# Altium project Base.PrjPCB
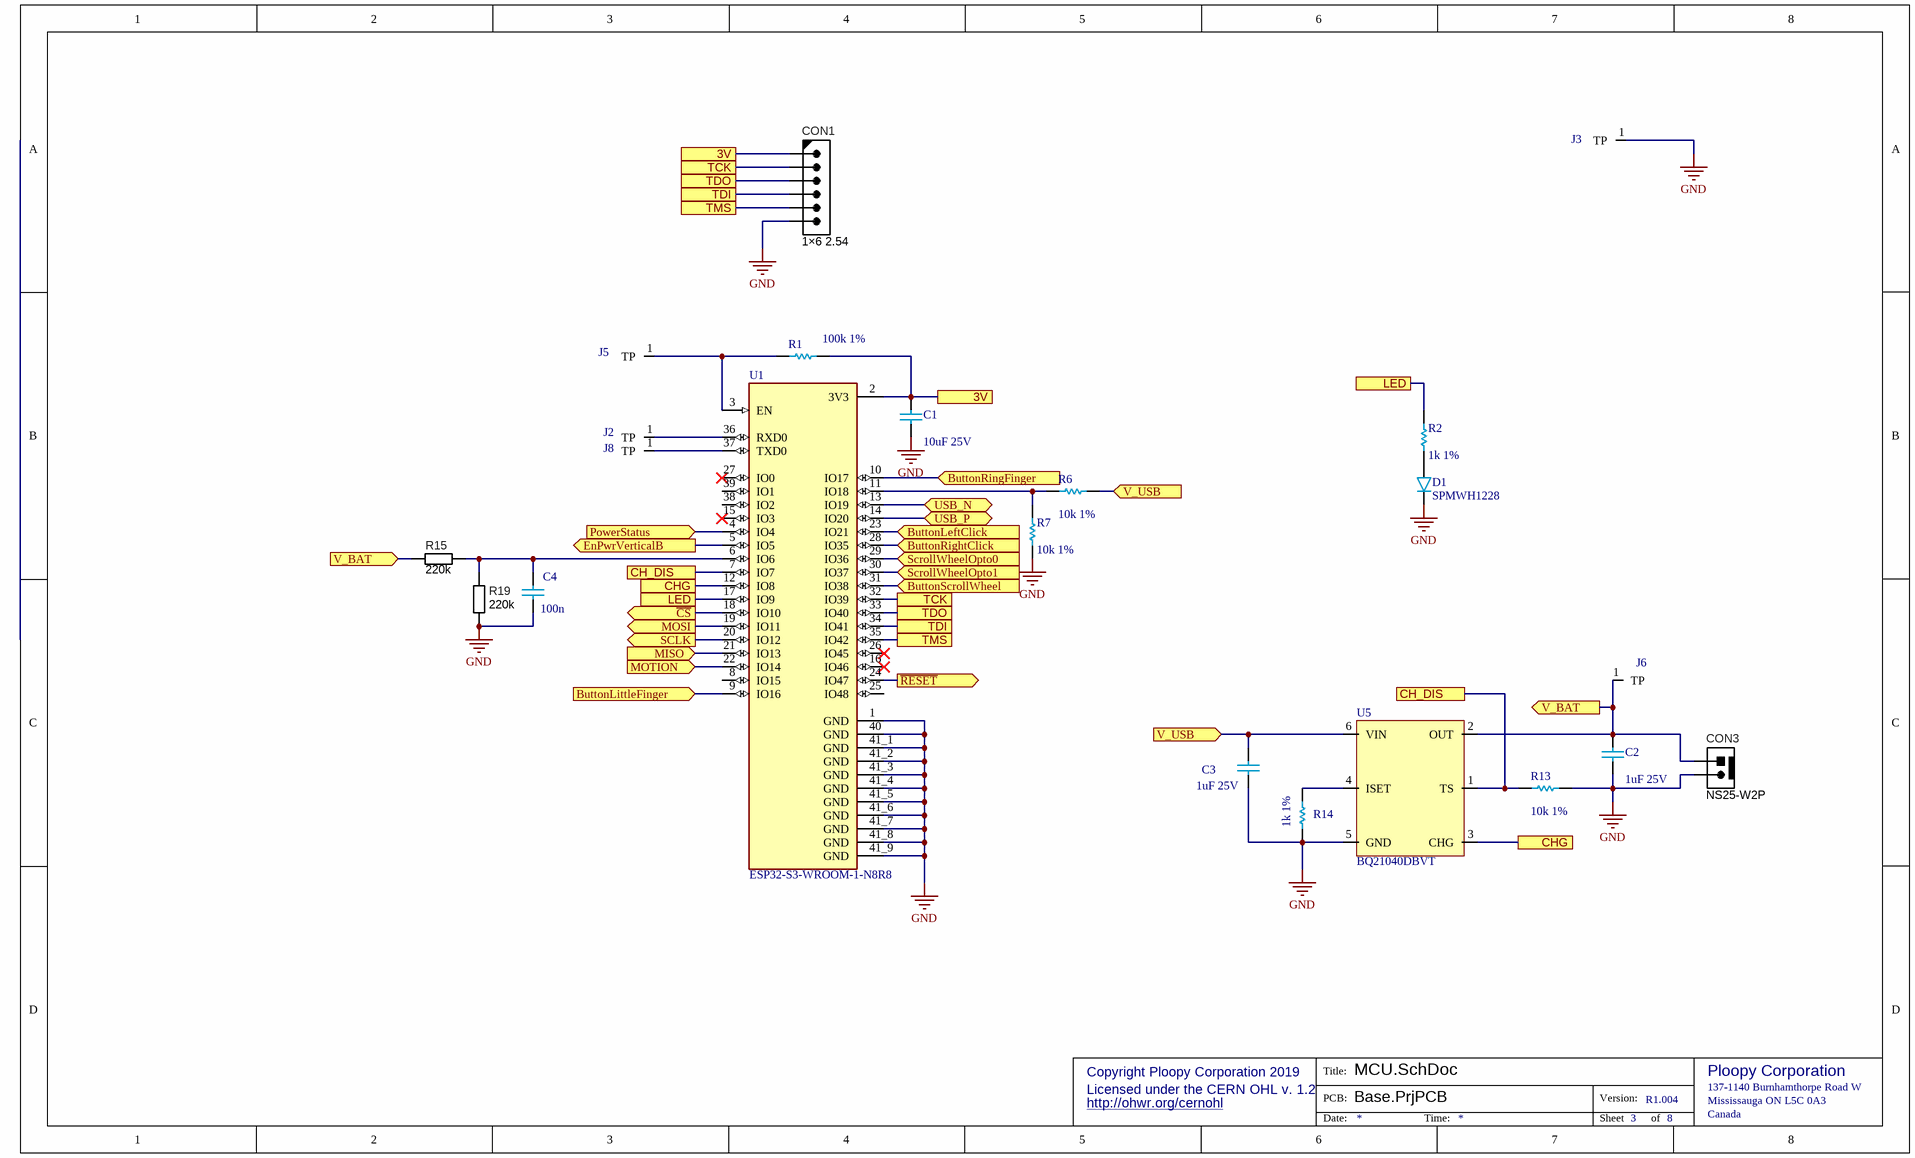
[diagram p0: MCU.SchDoc]
6 sheets, 76 parts. Net scope: flat (ports and power ports of the same name join across sheets).
Board file: Base.PcbDoc
Sheets:
  MCU.SchDoc
  USB.SchDoc
  VerticalPCBConnection.SchDoc
  MouseSensor.SchDoc
  Regulators.SchDoc
  LittleButtons.SchDoc

## Sheet MCU.SchDoc
size Legal; CompanyName: PloopyCo; Organization: Ploopy Co; Address1: 137-1140 Burnhamthorpe Road W; Address2: Mississauga; Address3: Ontario; Address4: Canada L5C 0A3; DocumentNumber: 3; Revision: R1.004; SheetNumber: 3; SheetTotal: 8

### Parts
C1  value 10uF 25V  [C0603]  (hidden comment: 0805)
C2  value 1uF 25V  [C0603]  (hidden comment: 0805)
C3  value 1uF 25V  [C0603]  (hidden comment: 0805)
C4  value 100n  [C0603]  (hidden comment: 0805)
CON1  1×6 2.54  [PH2.54_1X6]
CON3  NS25-W2P  [MOLEST_L2.54_2W]
D1  SPMWH1228  [SPMWH1228]
J2  TestPoint  [TestPoint]  (value not drawn)
J3  TestPoint  [TestPoint]  (value not drawn)
J5  TestPoint  [TestPoint]  (value not drawn)
J6  TestPoint  [TestPoint]  (value not drawn)
J8  TestPoint  [TestPoint]  (value not drawn)
R1  value 100k 1%  [R0603]  (hidden comment: 0805)
R2  value 1k 1%  [R0603]  (hidden comment: 0805)
R6  value 10k 1%  [R0603]  (hidden comment: 0805)
R7  value 10k 1%  [R0603]  (hidden comment: 0805)
R13  value 10k 1%  [R0603]  (hidden comment: 0805)
R14  value 1k 1%  [R0603]  (hidden comment: 0805)
R15  220k  [R0603]
R19  220k  [R0603]
U1  ESP32-S3-WROOM-1-N8R8  [XCVR_ESP32S3WROOM1N8R8]
U5  BQ21040DBVT  [PESD3V3S4UD - SOT95P275X110-6N]

### Ports
3V, ButtonLeftClick (in), ButtonLittleFinger (in), ButtonRightClick (in), ButtonRingFinger (in), ButtonScrollWheel (in), CH_DIS, CHG, EnPwrVerticalB (out), LED, MISO (in), MOSI (out), MOTION (in), PowerStatus (in), SCLK (out), ScrollWheelOpto0 (in), ScrollWheelOpto1 (in), TCK, TDI, TDO, TMS, USB_N (bidir), USB_P (bidir), V_BAT (in), V_BAT (out), V_USB (in), ~{CS} (out), ~{RESET} (out)

### Nets
GND: C1.1 C2.1 C3.1 C4.1 CON1.6 CON3.2 D1.2(C) J3.1(TP) R7.1 R13.1 R14.1 R19.1 U1.1(GND) U1.40(GND) U1.41_1(GND) U1.41_2(GND) U1.41_3(GND) U1.41_4(GND) U1.41_5(GND) U1.41_6(GND) U1.41_7(GND) U1.41_8(GND) U1.41_9(GND) U5.5(GND)
3V: C1.2 CON1.1 R1.2 U1.2(3V3) ; port 3V
ButtonLeftClick: U1.23(IO21) ; port ButtonLeftClick
ButtonLittleFinger: U1.9(IO16) ; port ButtonLittleFinger
ButtonRightClick: U1.28(IO35) ; port ButtonRightClick
ButtonRingFinger: U1.10(IO17) ; port ButtonRingFinger
ButtonScrollWheel: U1.31(IO38) ; port ButtonScrollWheel
~{CS}: U1.18(IO10) ; port ~{CS}
CH_DIS: R13.2 U1.7(IO7) U5.1(TS) ; port CH_DIS
CHG: U1.12(IO8) U5.3(CHG) ; port CHG
EnPwrVerticalB: U1.5(IO5) ; port EnPwrVerticalB
LED: R2.2 U1.17(IO9) ; port LED
MISO: U1.21(IO13) ; port MISO
MOSI: U1.19(IO11) ; port MOSI
MOTION: U1.22(IO14) ; port MOTION
PowerStatus: U1.4(IO4) ; port PowerStatus
~{RESET}: U1.24(IO47) ; port ~{RESET}
SCLK: U1.20(IO12) ; port SCLK
ScrollWheelOpto0: U1.29(IO36) ; port ScrollWheelOpto0
ScrollWheelOpto1: U1.30(IO37) ; port ScrollWheelOpto1
TCK: CON1.2 U1.32(IO39) ; port TCK
TDI: CON1.4 U1.34(IO41) ; port TDI
TDO: CON1.3 U1.33(IO40) ; port TDO
TMS: CON1.5 U1.35(IO42) ; port TMS
USB_N: U1.13(IO19) ; port USB_N
USB_P: U1.14(IO20) ; port USB_P
V_BAT: C2.2 CON3.1 J6.1(TP) R15.1 U5.2(OUT) ; port V_BAT
V_USB: C3.2 R6.2 U5.6(VIN) ; port V_USB
NetC4_2: C4.2 R15.2 R19.2 U1.6(IO6)
NetD1_1: D1.1(A) R2.1
NetJ2_1: J2.1(TP) U1.36(RXD0)
NetJ5_1: J5.1(TP) R1.1 U1.3(EN)
NetJ8_1: J8.1(TP) U1.37(TXD0)
NetR6_1: R6.1 R7.2 U1.11(IO18)
NetR14_2: R14.2 U5.4(ISET)

Not connected (* = marked no-connect by the designer): U1 8(IO15) 15(IO3)* 16(IO46)* 25(IO48) 26(IO45)* 27(IO0)* 38(IO2) 39(IO1)

### Notes on the sheet
- Copyright Ploopy Corporation 2019
- Licensed under the CERN OHL v. 1.2
- http://ohwr.org/cernohl
- Title:
- PCB:
- Version:
- Ploopy Corporation
- Mississauga ON L5C 0A3
- 137-1140 Burnhamthorpe Road W
- Date:
- Time:
- Sheet
- of
- Canada

### Library data of the parts
C1 = Cap 10uF 25V: 0805, X5R or better; PNP-Nzl: 2; PNP-dx: 0; PNP-X: 2.00; PNP-Y: 1.25; PNP-Lv: 1; PNP-TS: 70; PNP-Type: chi; PNP-FeedType: Tape; PNP-TapeWidth: 8; PNP-dy: 0; PNP-Pt: 0; PNP-W: 0; PNP-Thk: 1.25; PNP-Level: 1; PNP-Voff: 0; PNP-PlacePriority: 1; PNP-A: 0; PNP-TapeIndex: 1; Supplier 1: Mouser; Supplier Part Number 1: 81-GRM21BR61E106KA3L; Supplier 2: Digi-Key; Supplier Part Number 2: 490-5523-1-ND; PNP-da: 0
C2-C4 = Cap 1uF 25V: 0805, X5R or better; PNP-Nzl: 2; PNP-dx: 0; PNP-X: 2.00; PNP-Y: 1.25; PNP-Lv: 1; PNP-TS: 70; PNP-Type: chi; PNP-FeedType: Tape; PNP-TapeWidth: 8; Supplier 1: Digi-Key; Supplier Part Number 1: 1276-1066-2-ND; Supplier 2: Digi-Key; Supplier Part Number 2: 1276-1066-1-ND; PNP-dy: 0; PNP-Pt: 0; PNP-W: 0; PNP-Thk: 1.25; PNP-Level: 1; PNP-Voff: 0; PNP-PlacePriority: 1; PNP-A: 0; PNP-TapeIndex: 1; PNP-da: 0
CON1 = PH2.54_1X6: 1x3 standart 100mil pinheader
CON3 = MOLEST_L2.54_2W: Molex-like 2.54mm connector with lock
D1 = SPMWH1228: 3V/0.5W white LED, 2.8mm x 3.5mm; PNP-Nzl: 3; PNP-dx: 0; PNP-X: 2.8; PNP-Y: 3.2; PNP-A: 90; PNP-Thk: 0.65; PNP-Lv: 1; PNP-TS: 70; PNP-Type: chi; PNP-FeedType: Tape; PNP-TapeWidth: 8; PNP-PlacePriority: 2; PNP-da: 550; PNP-dy: 0; PNP-Pt: 0; PNP-W: 0; PNP-Level: 1; PNP-Voff: 0; PNP-TapeIndex: 1; Supplier 2: Digi-Key; Supplier Part Number 2: 1510-1428-1-ND; Supplier 3: Digi-Key; Supplier Part Number 3: 1510-1429-1-ND; Supplier 1: Arrow
R1 = Res 100k 1% 0805: Chip resistor; PNP-Nzl: 2; PNP-dx: 0; PNP-X: 2.00; PNP-Y: 1.25; PNP-Thk: 0.55; PNP-Lv: 1; PNP-TS: 70; PNP-Type: chi; PNP-FeedType: Tape; PNP-TapeWidth: 8; Supplier 1: Digi-Key; Supplier 2: Digi-Key; Supplier Part Number 1: RMCF0805FT100KTR-ND; Supplier Part Number 2: RMCF0805FT100KCT-ND; PNP-dy: 0; PNP-Pt: 0; PNP-W: 0; PNP-Level: 1; PNP-Voff: 0; PNP-PlacePriority: 1; PNP-A: 0; PNP-TapeIndex: 1; PNP-da: 0
R2 R14 = Res 1k 1% 0805: Chip resistor, 1/8W 100PPM; PNP-Nzl: 2; PNP-dx: 0; PNP-X: 2.00; PNP-Y: 1.25; PNP-Thk: 0.55; PNP-Lv: 1; PNP-TS: 70; PNP-Type: chi; PNP-FeedType: Tape; PNP-TapeWidth: 8; Supplier 1: Digi-Key; Supplier Part Number 1: RMCF0805FT1K00TR-ND; PNP-dy: 0; PNP-Pt: 0; PNP-W: 0; PNP-Level: 1; PNP-Voff: 0; PNP-PlacePriority: 1; PNP-A: 0; PNP-TapeIndex: 1; PNP-da: 0
R6 R7 R13 = Res 10k 1% 0805: Chip resistor; PNP-Nzl: 2; PNP-dx: 0; PNP-X: 2.00; PNP-Y: 1.25; PNP-Thk: 0.55; PNP-Lv: 1; PNP-TS: 70; PNP-Type: chi; PNP-FeedType: Tape; PNP-TapeWidth: 8; Supplier 1: Digi-Key; Supplier Part Number 1: RMCF0805FT10K0TR-ND; PNP-dy: 0; PNP-Pt: 0; PNP-W: 0; PNP-Level: 1; PNP-Voff: 0; PNP-PlacePriority: 1; PNP-A: 0; PNP-TapeIndex: 1; PNP-da: 0
R15 R19 = R0603: Generic 0603 resistor footprint
U1 = ESP32-S3-WROOM-1-N8R8: Bluetooth, WiFi 802.11b/g/n, Bluetooth v5.0 Transceiver Module 2.4GHz PCB Trace Surface Mount; MF: Espressif Systems; Package: None; Price: None; Check_prices: https://www.snapeda.com/parts/ESP32-S3-WROOM-1-N8R8/Espressif+Systems/view-part/?ref=eda; Value: *; SnapEDA_Link: https://www.snapeda.com/parts/ESP32-S3-WROOM-1-N8R8/Espressif+Systems/view-part/?ref=snap; MP: ESP32-S3-WROOM-1-N8R8; Availability: In Stock; Purchase-URL: https://pricing.snapeda.com/search?q=ESP32-S3-WROOM-1-N8R8&ref=eda

## Sheet USB.SchDoc
size Letter; CompanyName: PloopyCo; Organization: Ploopy Co; Address1: 137-1140 Burnhamthorpe Road W; Address2: Mississauga; Address3: Ontario; Address4: Canada L5C 0A3; DocumentNumber: 7; Revision: R1.004; SheetNumber: 7; SheetTotal: 8
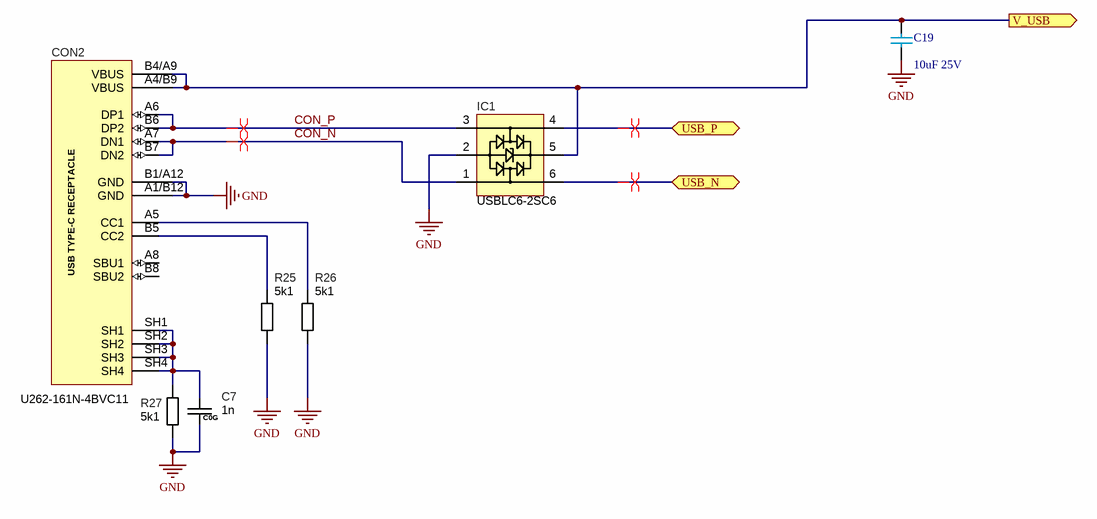
[diagram p1: USB.SchDoc]

### Parts
C7  1n  [C0603_C0G]
C19  value 10uF 25V  [C0603]  (hidden comment: 0805)
CON2  U262-161N-4BVC11  [USB_C]
IC1  USBLC6-2SC6  [sot23-6]
R25  5k1  [R0603]
R26  5k1  [R0603]
R27  5k1  [R0603]

### Ports
USB_N (bidir), USB_P (bidir), V_USB (out)

### Nets
GND: C7.2 C19.1 CON2.A1/B12(GND) CON2.B1/A12(GND) IC1.2(GND) R25.2 R26.2 R27.2
CON_N: CON2.A7(DN1) CON2.B7(DN2) IC1.1
CON_P: CON2.A6(DP1) CON2.B6(DP2) IC1.3
USB_N: IC1.6 ; port USB_N
USB_P: IC1.4 ; port USB_P
V_USB: C19.2 CON2.A4/B9(VBUS) CON2.B4/A9(VBUS) IC1.5(VBUS) ; port V_USB
NetC7_1: C7.1 CON2.SH1 CON2.SH2 CON2.SH3 CON2.SH4 R27.1
NetCON2_A5: CON2.A5(CC1) R26.1
NetCON2_B5: CON2.B5(CC2) R25.1

Not connected (* = marked no-connect by the designer): CON2 A8(SBU1) B8(SBU2)

### Layout directives
differential pair: CON_N, CON_P, USB_N, USB_P

### Notes on the sheet
- Copyright Ploopy Corporation 2019
- Licensed under the CERN OHL v. 1.2
- http://ohwr.org/cernohl
- Title:
- PCB:
- Version:
- Ploopy Corporation
- Mississauga ON L5C 0A3
- 137-1140 Burnhamthorpe Road W
- Date:
- Time:
- Sheet
- of
- Canada
- (in symbol C0603_C0G) C0G
- (in symbol USB_C_2.0) USB TYPE-C RECEPTACLE

### Library data of the parts
C7 = C0603_C0G: Precision 0603 C0G/NP0 capacitor footprint
C19 = Cap 10uF 25V: as C1 on sheet MCU; PNP-dy: 0; PNP-Pt: 0; PNP-W: 0; PNP-Thk: 1.25; PNP-Level: 1; PNP-Voff: 0; PNP-PlacePriority: 1; PNP-A: 0; PNP-TapeIndex: 1; Supplier 1: Mouser; Supplier Part Number 1: 81-GRM21BR61E106KA3L; Supplier 2: Digi-Key; Supplier Part Number 2: 490-5523-1-ND; PNP-da: 0
CON2 = USB_C_2.0: USB C 2.0 connector, SMT, female
IC1 = USBLC6-2SC6: USB 2.0 ESD protection
R25-R27 = R0603: Generic 0603 resistor footprint

## Sheet VerticalPCBConnection.SchDoc
size Letter; CompanyName: PloopyCo; Organization: Ploopy Co; Address1: 137-1140 Burnhamthorpe Road W; Address2: Mississauga; Address3: Ontario; Address4: Canada L5C 0A3; DocumentNumber: 8; Revision: R1.004; SheetNumber: 8; SheetTotal: 8
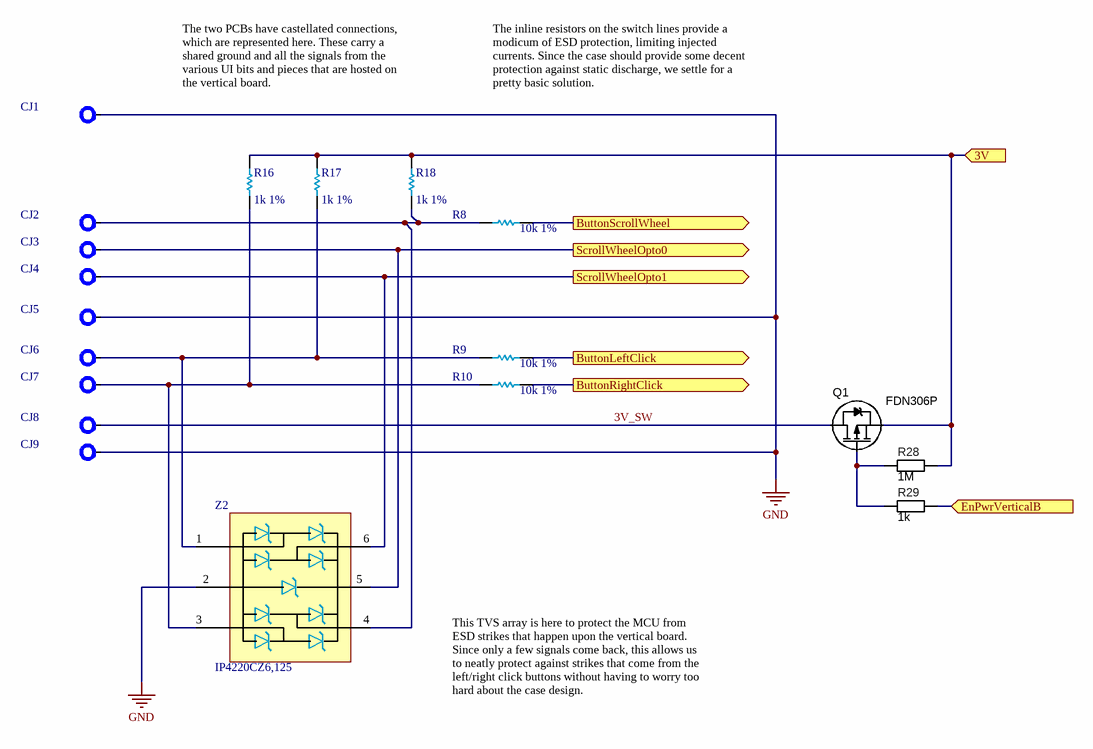
[diagram p2: VerticalPCBConnection.SchDoc]

### Parts
CJ1  PCBJointCastellationJoint  [PCBJoint]  (value not drawn)  (no BOM)
CJ2  PCBJointCastellationJoint  [PCBJoint]  (value not drawn)  (no BOM)
CJ3  PCBJointCastellationJoint  [PCBJoint]  (value not drawn)  (no BOM)
CJ4  PCBJointCastellationJoint  [PCBJoint]  (value not drawn)  (no BOM)
CJ5  PCBJointCastellationJoint  [PCBJoint]  (value not drawn)  (no BOM)
CJ6  PCBJointCastellationJoint  [PCBJoint]  (value not drawn)  (no BOM)
CJ7  PCBJointCastellationJoint  [PCBJoint]  (value not drawn)  (no BOM)
CJ8  PCBJointCastellationJoint  [PCBJoint]  (value not drawn)  (no BOM)
CJ9  PCBJointCastellationJoint  [PCBJoint]  (value not drawn)  (no BOM)
Q1  FDN306P  [SOT23-3]
R8  value 10k 1%  [R0603]  (hidden comment: 0805)
R9  value 10k 1%  [R0603]  (hidden comment: 0805)
R10  value 10k 1%  [R0603]  (hidden comment: 0805)
R16  value 1k 1%  [R0603]  (hidden comment: 0805)
R17  value 1k 1%  [R0603]  (hidden comment: 0805)
R18  value 1k 1%  [R0603]  (hidden comment: 0805)
R28  1M  [R0603]
R29  1k  [R0603]
Z2  IP4220CZ6,125  [PESD3V3S4UD - SOT95P275X110-6N]

### Ports
3V (in), ButtonLeftClick (out), ButtonRightClick (out), ButtonScrollWheel (out), EnPwrVerticalB (in), ScrollWheelOpto0 (out), ScrollWheelOpto1 (out)

### Nets
GND: CJ1.1 CJ5.1 CJ9.1 Z2.2
3V: Q1.2(S) R16.2 R17.2 R18.2 R28.2 ; port 3V
3V_SW: CJ8.1 Q1.3(D)
ButtonLeftClick: R9.2 ; port ButtonLeftClick
ButtonRightClick: R10.2 ; port ButtonRightClick
ButtonScrollWheel: R8.2 ; port ButtonScrollWheel
EnPwrVerticalB: R29.2 ; port EnPwrVerticalB
ScrollWheelOpto0: CJ3.1 Z2.5 ; port ScrollWheelOpto0
ScrollWheelOpto1: CJ4.1 Z2.6 ; port ScrollWheelOpto1
NetCJ2_1: CJ2.1 R8.1 R18.1 Z2.4
NetCJ6_1: CJ6.1 R9.1 R17.1 Z2.1
NetCJ7_1: CJ7.1 R10.1 R16.1 Z2.3
NetQ1_1: Q1.1(G) R28.1 R29.1

### Notes on the sheet
- The two PCBs have castellated connections, which are represented here. These carry a shared ground and all the signals from the various UI bits and pieces that are hosted on the vertical board.
- The inline resistors on the switch lines provide a modicum of ESD protection, limiting injected currents. Since the case should provide some decent protection against static discharge, we settle for a pretty basic solution.
- This TVS array is here to protect the MCU from ESD strikes that happen upon the vertical board. Since only a few signals come back, this allows us to neatly protect against strikes that come from the left/right click buttons without having to worry too hard about the case design.
- Copyright Ploopy Corporation 2019
- Licensed under the CERN OHL v. 1.2
- http://ohwr.org/cernohl
- Title:
- PCB:
- Version:
- Ploopy Corporation
- Mississauga ON L5C 0A3
- 137-1140 Burnhamthorpe Road W
- Date:
- Time:
- Sheet
- of
- Canada

### Library data of the parts
CJ1-CJ9 = PCBJoint: Pad for soldering a castellated PCB edge. Easy way to join two PCBs together.; PNP-Nzl: 2; PNP-dx: 0; PNP-X: 1; PNP-TS: 70; PNP-Type: CHI; PNP-FeedType: Tape; PNP-TapeWidth: 8; PNP-dy: 0; PNP-Y: 1; PNP-A: 0; PNP-Pt: 0; PNP-W: 0; PNP-Thk: 1; PNP-Lv: 1; PNP-Level: 1; PNP-Voff: 0; PNP-PlacePriority: 1; PNP-TapeIndex: 1; PNP-da: 0
Q1 = MOS_P_PMV75UP: 20 V, P-channel, 90mOhm @ 3V3
R8-R10 = Res 10k 1% 0805: as R6 on sheet MCU; Supplier 1: Digi-Key; Supplier Part Number 1: RMCF0805FT10K0TR-ND; PNP-dy: 0; PNP-Pt: 0; PNP-W: 0; PNP-Level: 1; PNP-Voff: 0; PNP-PlacePriority: 1; PNP-A: 0; PNP-TapeIndex: 1; PNP-da: 0
R16-R18 = Res 1k 1% 0805: as R2 on sheet MCU; Supplier 1: Digi-Key; Supplier Part Number 1: RMCF0805FT1K00TR-ND; PNP-dy: 0; PNP-Pt: 0; PNP-W: 0; PNP-Level: 1; PNP-Voff: 0; PNP-PlacePriority: 1; PNP-A: 0; PNP-TapeIndex: 1; PNP-da: 0
R28 R29 = R0603: Generic 0603 resistor footprint
Z2 = IP4220CZ6,125: TVS DIODE 5.5V 6TSOP (Low capacitance, USB); PNP-Nzl: 2; PNP-dx: 0; PNP-X: 2.9; PNP-Y: 1.3; PNP-A: 270; PNP-Thk: 1; PNP-Lv: 26; PNP-TS: 90; PNP-Type: CHP; PNP-FeedType: Tape; PNP-TapeWidth: 8; PNP-PlacePriority: 3; PNP-dy: 0; PNP-Pt: 0; PNP-W: 0; PNP-Level: 1; PNP-Voff: 0; PNP-TapeIndex: 1; PNP-da: 0; Supplier 1: Digi-Key; Supplier 2: Mouser; Supplier 3: Arrow; Supplier Part Number 1: 1727-3578-1-ND; Supplier Part Number 2: 771-IP4220CZ6-T/R; Supplier Part Number 3: IP4220CZ6,125

## Sheet MouseSensor.SchDoc
size Letter; CompanyName: PloopyCo; Organization: Ploopy Co; Address1: 137-1140 Burnhamthorpe Road W; Address2: Mississauga; Address3: Ontario; Address4: Canada L5C 0A3; DocumentNumber: 5; Revision: R1.004; SheetNumber: 5; SheetTotal: 8
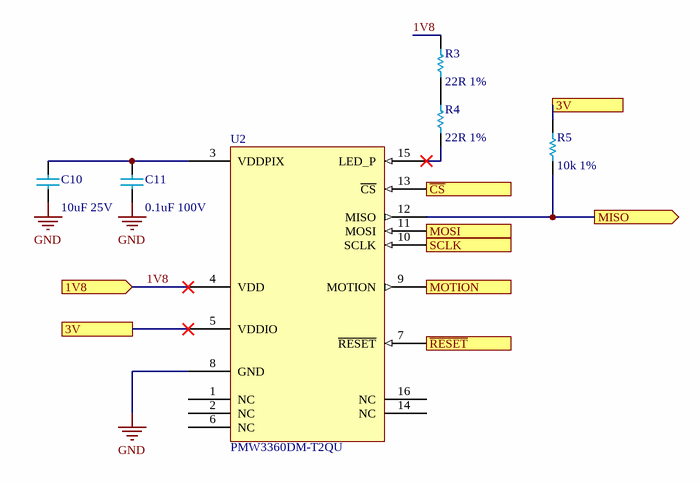
[diagram p3: MouseSensor.SchDoc]

### Parts
C10  value 10uF 25V  [C0603]  (hidden comment: 0805)
C11  value 0.1uF 100V  [C0603]  (hidden comment: 0805)
R3  value 22R 1%  [R0603]  (hidden comment: 0805)
R4  value 22R 1%  [R0603]  (hidden comment: 0805)
R5  value 10k 1%  [R0603]  (hidden comment: 0805)
U2  PMW3360DM-T2QU  [PMW3360DM-T2QU]

### Ports
1V8 (in), 3V, MISO (out), MOSI (in), MOTION (out), SCLK (in), ~{CS} (in), ~{RESET} (in)

### Nets
GND: C10.1 C11.1 U2.8(GND)
1V8: R3.2 U2.4(VDD) ; port 1V8
3V: R5.2 U2.5(VDDIO) ; port 3V
~{CS}: U2.13(~{CS}) ; port ~{CS}
MISO: R5.1 U2.12(MISO) ; port MISO
MOSI: U2.11(MOSI) ; port MOSI
MOTION: U2.9(MOTION) ; port MOTION
~{RESET}: U2.7(~{RESET}) ; port ~{RESET}
SCLK: U2.10(SCLK) ; port SCLK
NetC10_2: C10.2 C11.2 U2.3(VDDPIX)
NetR3_1: R3.1 R4.2
NetR4_1: R4.1 U2.15(LED_P)

Not connected (* = marked no-connect by the designer): U2 1(NC) 2(NC) 6(NC) 14(NC) 16(NC)

### Notes on the sheet
- Copyright Ploopy Corporation 2019
- Licensed under the CERN OHL v. 1.2
- http://ohwr.org/cernohl
- Title:
- PCB:
- Version:
- Ploopy Corporation
- Mississauga ON L5C 0A3
- 137-1140 Burnhamthorpe Road W
- Date:
- Time:
- Sheet
- of
- Canada

### Library data of the parts
C10 = Cap 10uF 25V: as C1 on sheet MCU; PNP-dy: 0; PNP-Pt: 0; PNP-W: 0; PNP-Thk: 1.25; PNP-Level: 1; PNP-Voff: 0; PNP-PlacePriority: 1; PNP-A: 0; PNP-TapeIndex: 1; Supplier 1: Mouser; Supplier Part Number 1: 81-GRM21BR61E106KA3L; Supplier 2: Digi-Key; Supplier Part Number 2: 490-5523-1-ND; PNP-da: 0
C11 = Cap 0.1uF 100V: 0805, X5R or better; PNP-Nzl: 2; PNP-dx: 0; PNP-Level: 1; PNP-Thk: 1.05; PNP-TS: 70; PNP-Type: chi; PNP-X: 2.00; PNP-Y: 1.25; PNP-FeedType: Tape; PNP-TapeWidth: 8; Supplier 1: Digi-Key; Supplier Part Number 1: 1276-6840-2-ND; PNP-dy: 0; PNP-Lv: 1; PNP-Pt: 0; PNP-Voff: 0; PNP-W: 0; PNP-A: 0; PNP-PlacePriority: 1; PNP-TapeIndex: 1; PNP-da: 0
R3 R4 = Res 22R 1% 0805: Chip resistor; PNP-Nzl: 2; PNP-dx: 0; PNP-X: 2.00; PNP-Y: 1.25; PNP-Thk: 0.55; PNP-Lv: 1; PNP-TS: 70; PNP-Type: chi; PNP-FeedType: Tape; PNP-TapeWidth: 8; PNP-dy: 0; PNP-Pt: 0; PNP-W: 0; PNP-Level: 1; PNP-Voff: 0; PNP-PlacePriority: 1; PNP-A: 0; PNP-TapeIndex: 1; PNP-da: 0; Supplier 1: Digi-Key; Supplier 2: Arrow; Supplier Part Number 1: RMCF0805FT22R0CT-ND; Supplier Part Number 2: RMCF0805FT22R0
R5 = Res 10k 1% 0805: as R6 on sheet MCU; Supplier 1: Digi-Key; Supplier Part Number 1: RMCF0805FT10K0TR-ND; PNP-dy: 0; PNP-Pt: 0; PNP-W: 0; PNP-Level: 1; PNP-Voff: 0; PNP-PlacePriority: 1; PNP-A: 0; PNP-TapeIndex: 1; PNP-da: 0
U2 = PMW3360DM-T2QU: Optical Gaming Navigation Sensor; PNP-Nzl: 4; PNP-dx: 0; PNP-X: 4.9; PNP-Y: 3.9; PNP-W: 0.1; PNP-Thk: 1.45; PNP-Lv: 26; PNP-TS: 70; PNP-Level: 1.3; PNP-Type: QFP; PNP-FeedType: Tape; PNP-TapeWidth: 12; PNP-PlacePriority: 3; PNP-TapeIndex: 2; PNP-dy: 0; PNP-A: 0; PNP-Pt: 0; PNP-Voff: 0; PNP-da: 0

## Sheet Regulators.SchDoc
size Letter; CompanyName: PloopyCo; Organization: Ploopy Co; Address1: 137-1140 Burnhamthorpe Road W; Address2: Mississauga; Address3: Ontario; Address4: Canada L5C 0A3; DocumentNumber: 6; Revision: R1.004; SheetNumber: 6; SheetTotal: 8
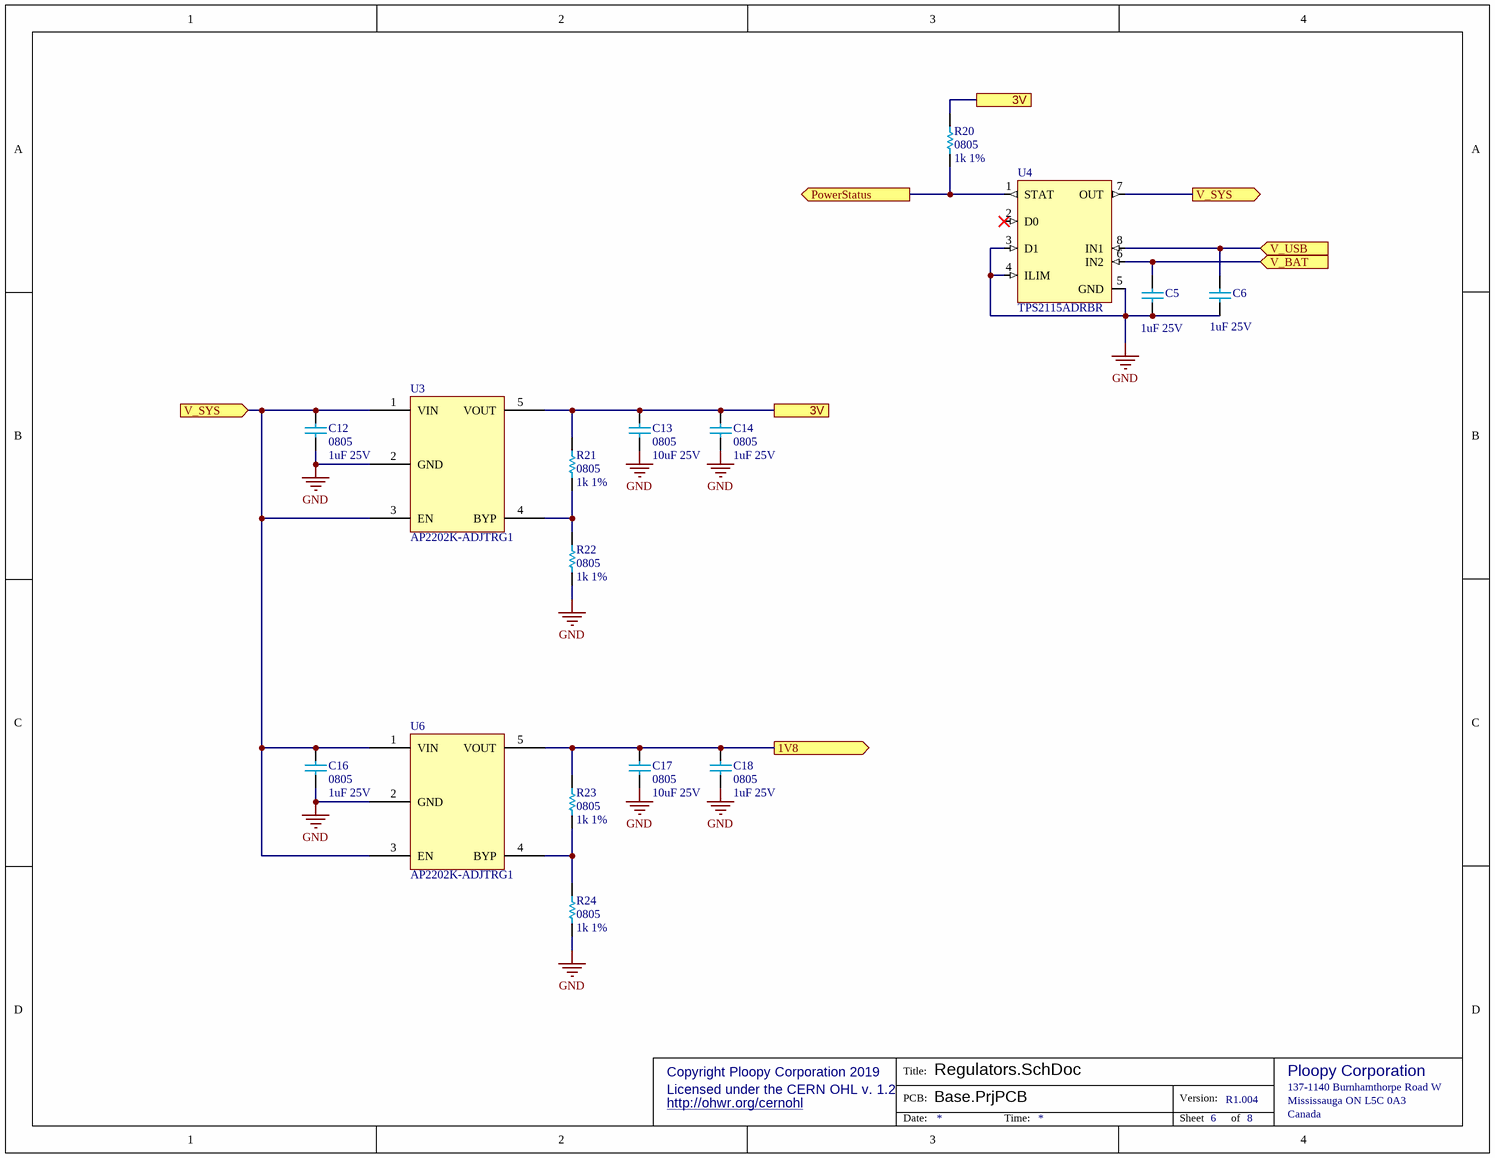
[diagram p4: Regulators.SchDoc]

### Parts
C5  value 1uF 25V  [C0603]  (hidden comment: 0805)
C6  value 1uF 25V  [C0603]  (hidden comment: 0805)
C12  0805  value 1uF 25V  [C0603]
C13  0805  value 10uF 25V  [C0603]
C14  0805  value 1uF 25V  [C0603]
C16  0805  value 1uF 25V  [C0603]
C17  0805  value 10uF 25V  [C0603]
C18  0805  value 1uF 25V  [C0603]
R20  0805  value 1k 1%  [0603]
R21  0805  value 1k 1%  [0603]
R22  0805  value 1k 1%  [0603]
R23  0805  value 1k 1%  [0603]
R24  0805  value 1k 1%  [0603]
U3  AP2202K-ADJTRG1  [AP2202 - SOT95P270X145-5N]
U4  TPS2115ADRBR  [TSSOP-8]
U6  AP2202K-ADJTRG1  [AP2202 - SOT95P270X145-5N]

### Ports
1V8 (out), 3V, PowerStatus (out), V_BAT (in), V_SYS (in), V_SYS (out), V_USB (in)

### Nets
GND: C5.1 C6.1 C12.1 C13.1 C14.1 C16.1 C17.1 C18.1 R22.1 R24.1 U3.2(GND) U4.3(D1) U4.4(ILIM) U4.5(GND) U6.2(GND)
1V8: C17.2 C18.2 R23.2 U6.5(VOUT) ; port 1V8
3V: C13.2 C14.2 R20.2 R21.2 U3.5(VOUT) ; port 3V
PowerStatus: R20.1 U4.1(STAT) ; port PowerStatus
V_BAT: C5.2 U4.6(IN2) ; port V_BAT
V_SYS: C12.2 C16.2 U3.1(VIN) U3.3(EN) U4.7(OUT) U6.1(VIN) U6.3(EN) ; port V_SYS
V_USB: C6.2 U4.8(IN1) ; port V_USB
NetR21_1: R21.1 R22.2 U3.4(BYP)
NetR23_1: R23.1 R24.2 U6.4(BYP)

Not connected (* = marked no-connect by the designer): U4 2(D0)*

### Notes on the sheet
- Copyright Ploopy Corporation 2019
- Licensed under the CERN OHL v. 1.2
- http://ohwr.org/cernohl
- Title:
- PCB:
- Version:
- Ploopy Corporation
- Mississauga ON L5C 0A3
- 137-1140 Burnhamthorpe Road W
- Date:
- Time:
- Sheet
- of
- Canada

### Library data of the parts
C5 C6 C12 C14 C16 C18 = Cap 1uF 25V: 0805, X5R or better; PNP-Nzl: 2; PNP-dx: 0; PNP-Level: 1; PNP-Thk: 1.25; PNP-TS: 70; PNP-Type: chi; PNP-X: 2.00; PNP-FeedType: Tape; PNP-TapeWidth: 8; Supplier 1: Digi-Key; Supplier Part Number 1: 1276-1066-2-ND; Supplier 2: Digi-Key; Supplier Part Number 2: 1276-1066-1-ND; PNP-dy: 0; PNP-Lv: 1; PNP-Pt: 0; PNP-Voff: 0; PNP-W: 0; PNP-Y: 1.25; PNP-A: 0; PNP-PlacePriority: 1; PNP-TapeIndex: 1; PNP-da: 0
C13 C17 = Cap 10uF 25V: as C1 on sheet MCU; PNP-dy: 0; PNP-Pt: 0; PNP-W: 0; PNP-Thk: 1.25; PNP-Level: 1; PNP-Voff: 0; PNP-PlacePriority: 1; PNP-A: 0; PNP-TapeIndex: 1; Supplier 1: Mouser; Supplier Part Number 1: 81-GRM21BR61E106KA3L; Supplier 2: Digi-Key; Supplier Part Number 2: 490-5523-1-ND; PNP-da: 0
R20-R24 = Res 1k 1% 0805: as R2 on sheet MCU; Supplier 1: Digi-Key; Supplier Part Number 1: RMCF0805FT1K00TR-ND; PNP-dy: 0; PNP-Pt: 0; PNP-W: 0; PNP-Level: 1; PNP-Voff: 0; PNP-PlacePriority: 1; PNP-A: 0; PNP-TapeIndex: 1; PNP-da: 0
U3 U6 = AP2202K-3.3: 3.3V 150mA LDO regulator; PNP-Nzl: 2; PNP-dx: 0; PNP-X: 2.9; PNP-Y: 1.3; PNP-A: 90; PNP-Thk: 1; PNP-Lv: 26; PNP-Type: CHP; PNP-FeedType: Tape; PNP-TapeWidth: 8; PNP-PlacePriority: 3; PNP-dy: 0; PNP-Pt: 0; PNP-W: 0; PNP-TS: 90; PNP-Level: 1; PNP-Voff: 0; PNP-TapeIndex: 1; Supplier 1: Mouser; Supplier Part Number 1: 621-AP2202K-3.3TRG1; Supplier 2: Digi-Key; Supplier Part Number 2: AP2202K-3.3TRG1DICT-ND; Supplier 3: Arrow; Supplier Part Number 3: PWagzdsTFFHKE_U17B45SP-NtndBrheJIaI5hB7gHD0ZVywxIBNyoAQstvnyfZZ0; PNP-da: 0

## Sheet LittleButtons.SchDoc
size Letter; CompanyName: PloopyCo; Organization: Ploopy Co; Address1: 137-1140 Burnhamthorpe Road W; Address2: Mississauga; Address3: Ontario; Address4: Canada L5C 0A3; DocumentNumber: 2; Revision: R1.004; SheetNumber: 2; SheetTotal: 8
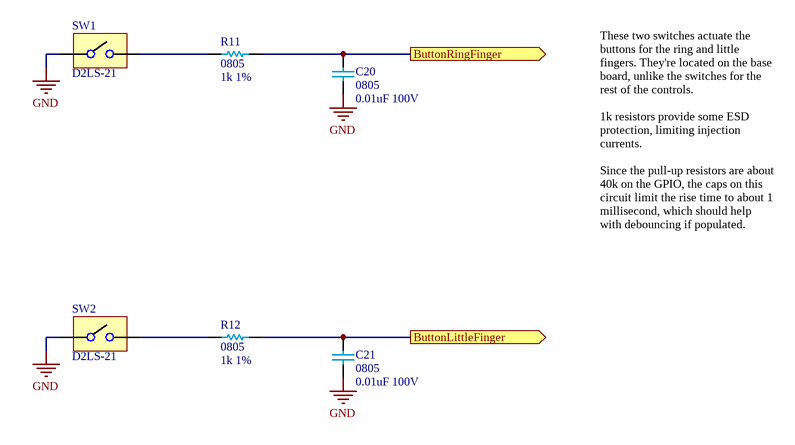
[diagram p5: LittleButtons.SchDoc]

### Parts
C20  0805  value 0.01uF 100V  [C0603]
C21  0805  value 0.01uF 100V  [C0603]
R11  0805  value 1k 1%  [0603]
R12  0805  value 1k 1%  [0603]
SW1  D2LS-21  [D2LS-21]
SW2  D2LS-21  [D2LS-21]

### Ports
ButtonLittleFinger (out), ButtonRingFinger (out)

### Nets
GND: C20.1 C21.1 SW1.A SW2.A
ButtonLittleFinger: C21.2 R12.2 ; port ButtonLittleFinger
ButtonRingFinger: C20.2 R11.2 ; port ButtonRingFinger
NetR11_1: R11.1 SW1.B
NetR12_1: R12.1 SW2.B

### Notes on the sheet
- These two switches actuate the buttons for the ring and little fingers. They're located on the base board, unlike the switches for the rest of the controls.
  1k resistors provide some ESD protection, limiting injection currents.
  Since the pull-up resistors are about 40k on the GPIO, the caps on this circuit limit the rise time to about 1 millisecond, which should help with debouncing if populated.
- Copyright Ploopy Corporation 2019
- Licensed under the CERN OHL v. 1.2
- http://ohwr.org/cernohl
- Title:
- PCB:
- Version:
- Ploopy Corporation
- Mississauga ON L5C 0A3
- 137-1140 Burnhamthorpe Road W
- Date:
- Time:
- Sheet
- of
- Canada

### Library data of the parts
C20 C21 = Cap 0.01uF 100V: 0805, X5R or better; PNP-Nzl: 2; PNP-dx: 0; PNP-X: 2.00; PNP-Y: 1.25; PNP-Thk: 0.85; PNP-Lv: 1; PNP-TS: 70; PNP-Type: chi; PNP-FeedType: Tape; PNP-TapeWidth: 8; PNP-dy: 0; PNP-Pt: 0; PNP-W: 0; PNP-Level: 1; PNP-Voff: 0; PNP-PlacePriority: 1; PNP-A: 0; PNP-TapeIndex: 1; Supplier 1: Digi-Key; Supplier Part Number 1: 1276-6845-2-ND; Supplier 2: Arrow; Supplier Part Number 2: HFLC7Kmwq4-6R2SVzaQAUvCwxvZH1YjWdj_EBba1ByE; PNP-da: 0
R11 R12 = Res 1k 1% 0805: as R2 on sheet MCU; Supplier 1: Digi-Key; Supplier Part Number 1: RMCF0805FT1K00TR-ND; PNP-dy: 0; PNP-Pt: 0; PNP-W: 0; PNP-Level: 1; PNP-Voff: 0; PNP-PlacePriority: 1; PNP-A: 0; PNP-TapeIndex: 1; PNP-da: 0
SW1 SW2 = D2LS-21: Compact Surface-mounting Switch for long durability; Supplier 1: Digi-Key; Supplier 2: Mouser; Supplier Part Number 1: Z4378CT-ND; Supplier Part Number 2: 653-D2LS-21

## Nets that join several sheets
GND: MCU (24 pins), USB (8 pins), VerticalPCBConnection (CJ1.1 CJ5.1 CJ9.1 Z2.2), MouseSensor (C10.1 C11.1 U2.8), Regulators (15 pins), LittleButtons (C20.1 C21.1 SW1.A SW2.A)
1V8: MouseSensor (R3.2 U2.4), Regulators (C17.2 C18.2 R23.2 U6.5)
3V: MCU (C1.2 CON1.1 R1.2 U1.2), VerticalPCBConnection (5 pins), MouseSensor (R5.2 U2.5), Regulators (5 pins)
ButtonLeftClick: MCU (U1.23), VerticalPCBConnection (R9.2)
ButtonLittleFinger: MCU (U1.9), LittleButtons (C21.2 R12.2)
ButtonRightClick: MCU (U1.28), VerticalPCBConnection (R10.2)
ButtonRingFinger: MCU (U1.10), LittleButtons (C20.2 R11.2)
ButtonScrollWheel: MCU (U1.31), VerticalPCBConnection (R8.2)
~{CS}: MCU (U1.18), MouseSensor (U2.13)
EnPwrVerticalB: MCU (U1.5), VerticalPCBConnection (R29.2)
MISO: MCU (U1.21), MouseSensor (R5.1 U2.12)
MOSI: MCU (U1.19), MouseSensor (U2.11)
MOTION: MCU (U1.22), MouseSensor (U2.9)
PowerStatus: MCU (U1.4), Regulators (R20.1 U4.1)
~{RESET}: MCU (U1.24), MouseSensor (U2.7)
SCLK: MCU (U1.20), MouseSensor (U2.10)
ScrollWheelOpto0: MCU (U1.29), VerticalPCBConnection (CJ3.1 Z2.5)
ScrollWheelOpto1: MCU (U1.30), VerticalPCBConnection (CJ4.1 Z2.6)
USB_N: MCU (U1.13), USB (IC1.6)
USB_P: MCU (U1.14), USB (IC1.4)
V_BAT: MCU (5 pins), Regulators (C5.2 U4.6)
V_USB: MCU (C3.2 R6.2 U5.6), USB (C19.2 CON2.A4/B9 CON2.B4/A9 IC1.5), Regulators (C6.2 U4.8)

## Assembly variants
BoM: not fitted LBS.C.20 LBS.C.21 MCU.C.2 MCU.C.3